# Altium schematic sheet USB-UART Converter (CP2102).SchDoc: - - - - -
size A4; ApprovedBy: LD Stanton; Author: LD Stanton; CompanyName: University of Cape Town; DrawnBy: Lawrence Stanton; Engineer: Lawrence Stanton; Organization: University of Cape Town; Address1: Department of Electrical Engineering; Address2: Rondebosch; Address3: Cape Town; Address4: South Africa 7701; DocumentNumber: 16; SheetNumber: 16; SheetTotal: 20
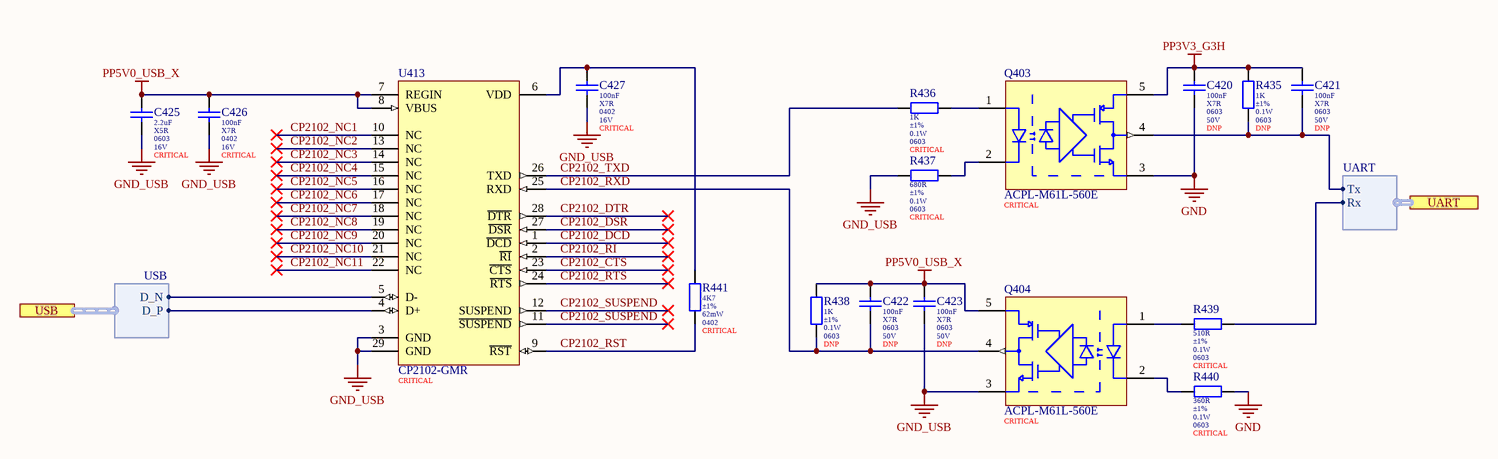
[diagram p0: USB-UART Converter (CP2102).SchDoc]

## Parts
C420  value 100nF  Dielectric: X7R  Package: 0603  Voltage: 50V  Populate: DNP  [0603 (Yageo DA) B]  (hidden comment: CC0603KRX7R9BB104)
C421  value 100nF  Dielectric: X7R  Package: 0603  Voltage: 50V  Populate: DNP  [0603 (Yageo DA) B]  (hidden comment: CC0603KRX7R9BB104)
C422  value 100nF  Dielectric: X7R  Package: 0603  Voltage: 50V  Populate: DNP  [0603 (Yageo DA) B]  (hidden comment: CC0603KRX7R9BB104)
C423  value 100nF  Dielectric: X7R  Package: 0603  Voltage: 50V  Populate: DNP  [0603 (Yageo DA) B]  (hidden comment: CC0603KRX7R9BB104)
C425  value 2.2uF  Dielectric: X5R  Package: 0603  Voltage: 16V  Populate: CRITICAL  [0603_080_8 (Samsung) B]  (hidden comment: CL10A225KO8NNNC)
C426  value 100nF  Dielectric: X7R  Package: 0402  Voltage: 16V  Populate: CRITICAL  [0402_050_5 (Samsumg) B]  (hidden comment: CL05B104KO5NNNC)
C427  value 100nF  Dielectric: X7R  Package: 0402  Voltage: 16V  Populate: CRITICAL  [0402_050_5 (Samsumg) B]  (hidden comment: CL05B104KO5NNNC)
Q403  ACPL-M61L-560E  Placement: CRITICAL  [SO-5 (ACPL) B]
Q404  ACPL-M61L-560E  Placement: CRITICAL  [SO-5 (ACPL) B]
R435  value 1K  Tolerance: ±1%  Power: 0.1W  Package: 0603  Populate: DNP  [0603 (Uniroyal) B]  (hidden comment: 0603WAF1001T5E)
R436  value 1K  Tolerance: ±1%  Power: 0.1W  Package: 0603  Populate: CRITICAL  [0603 (Uniroyal) B]  (hidden comment: 0603WAF1001T5E)
R437  value 680R  Tolerance: ±1%  Power: 0.1W  Package: 0603  Populate: CRITICAL  [0603 (Uniroyal) B]  (hidden comment: 0603WAF6800T5E)
R438  value 1K  Tolerance: ±1%  Power: 0.1W  Package: 0603  Populate: DNP  [0603 (Uniroyal) B]  (hidden comment: 0603WAF1001T5E)
R439  value 510R  Tolerance: ±1%  Power: 0.1W  Package: 0603  Populate: CRITICAL  [0603 (Uniroyal) B]  (hidden comment: 0603WAF5100T5E)
R440  value 360R  Tolerance: ±1%  Power: 0.1W  Package: 0603  Populate: CRITICAL  [0603 (Uniroyal) B]  (hidden comment: 0603WAF3600T5E)
R441  value 4K7  Tolerance: ±1%  Power: 62mW  Package: 0402  Populate: CRITICAL  [0402 (Uniroyal) C]  (hidden comment: 0402WGF4701TCE)
U413  CP2102-GMR  Placement: CRITICAL  [QFN28 (CP2102-GMR) C]

## Ports
UART (harness UART), USB (harness USB)

## Harnesses
USB: D_P, D_N
UART: Rx, Tx

## Nets
GND: C420.2 Q403.3(GND) R440.2
GND_USB: C423.2 C425.2 C426.2 C427.2 Q404.3(GND) R437.1 U413.3(GND) U413.29(GND)
PP3V3_G3H: C420.1 C421.1 Q403.5(VDD) R435.2
PP5V0_USB_X: C422.1 C423.1 C425.1 C426.1 Q404.5(VDD) R438.2 U413.7(REGIN) U413.8(VBUS)
CP2102_CTS: U413.23(~{CTS})
CP2102_DCD: U413.1(~{DCD})
CP2102_DSR: U413.27(~{DSR})
CP2102_DTR: U413.28(~{DTR})
CP2102_NC1: U413.10(NC)
CP2102_NC2: U413.13(NC)
CP2102_NC3: U413.14(NC)
CP2102_NC4: U413.15(NC)
CP2102_NC5: U413.16(NC)
CP2102_NC6: U413.17(NC)
CP2102_NC7: U413.18(NC)
CP2102_NC8: U413.19(NC)
CP2102_NC9: U413.20(NC)
CP2102_NC10: U413.21(NC)
CP2102_NC11: U413.22(NC)
CP2102_RI: U413.2(~{RI})
CP2102_RST: R441.2 U413.9(~{RST})
CP2102_RTS: U413.24(~{RTS})
CP2102_RXD: C422.2 Q404.4(VO) R438.1 U413.25(RXD)
CP2102_~{SUSPEND}: U413.11(~{SUSPEND})
CP2102_SUSPEND: U413.12(SUSPEND)
CP2102_TXD: R436.1 U413.26(TXD)
NetC421_2: C421.2 Q403.4(VO) R435.1 ; port UART.Tx
NetC427_1: C427.1 R441.1 U413.6(VDD)
NetQ403_1: Q403.1(A) R436.2
NetQ403_2: Q403.2(C) R437.2
NetQ404_1: Q404.1(A) R439.1
NetQ404_2: Q404.2(C) R440.1
NetR439_2: R439.2 ; port UART.Rx
NetU413_4: U413.4(D+) ; port USB.D_P
NetU413_5: U413.5(D-) ; port USB.D_N

## Notes on the sheet
- Size:
- Date:
- A4
- Number:
- Time:
- Revision:
- Sheet
- of
- File:
- Author:

## Library data of the parts
C420-C423 = CMP-047-000000-7: MLCC 100nF 50V 0603 X7R ±10%; Manufacturer: Yageo; LCSC Part Number: C14663; Tolerance: ±10%; ComponentLink1URL: https://datasheet.lcsc.com/szlcsc/YAGEO-CC0603KRX7R9BB104_C14663.pdf; ComponentLink1Description: Datasheet
C425 = CMP-045-000016-8: MLCC 2.2uF 0603 16V X5R ±10%; Manufacturer: Samsung; ComponentLink1URL: https://datasheet.lcsc.com/szlcsc/Samsung-Electro-Mechanics-CL05C100JB5NNNC_C32949.pdf; LCSC Part Number: C23630; Tolerance: ±10%; ComponentLink1Description: Datasheet
C426 C427 = CMP-045-000014-12: MLCC 100nF 0402 16V X7R ±10%; Manufacturer: Samsung; ComponentLink1Description: Datasheet; ComponentLink1URL: https://datasheet.lcsc.com/szlcsc/Samsung-Electro-Mechanics-CL05C100JB5NNNC_C32949.pdf; LCSC Part Number: C1525; Tolerance: ±10%
Q403 Q404 = CMP-00026-00000-1: Optocoupler Logic-Out Totem-Pole DC-IN 1-CH SO-5; Propagation Delay: 80ns; Forward Voltage: 1.3V; Forward Current: 2mA; Output Current: 10mA; Isolation Voltage: 3.75kV; ComponentLink1URL: https://datasheet.lcsc.com/lcsc/1912111437_AVAGO-Broadcom-ACPL-M61L-500E_C44908.pdf; Case/Package: SO; ComponentLink1Description: Datasheet; LCSC Part Number: C691956; Min Operating Temperature: -40°C; Max Operating Temperature: 105°C; RoHS Compliant: Yes
R435 R436 R438 = CMP-010-000308-10: Resistor 1K0 0603 ±1% Thick Film Uniroyal; Working Voltage: 50V; Temperature Coefficient: ±100ppm/K; ComponentLink1URL: https://datasheet.lcsc.com/szlcsc/1811062009_UNI-ROYAL-Uniroyal-Elec-0603WAF1002T5E_C25804.pdf; LCSC Part Number: C21190; Pin Count: 2; Manufacturer: Uniroyal; ComponentLink1Description: Datasheet; Temperature: -55 - 155°C
R437 = CMP-010-000394-2: Resistor 680R 0603 ±1% Thick Film Uniroyal; Working Voltage: 50V; Temperature Coefficient: ±100ppm/K; ComponentLink1Description: Datasheet; Pin Count: 2; ComponentLink1URL: https://datasheet.lcsc.com/szlcsc/1811062009_UNI-ROYAL-Uniroyal-Elec-0603WAF1002T5E_C25804.pdf; Temperature: -55 - 155°C; Manufacturer: Uniroyal; LCSC Part Number: C23228
R439 = CMP-010-000390-1: Resistor 510R 0603 ±1% Thick Film Uniroyal; Temperature Coefficient: ±200ppm/K; Working Voltage: 50V; Pin Count: 2; LCSC Part Number: C23193; ComponentLink1URL: https://datasheet.lcsc.com/szlcsc/1811062009_UNI-ROYAL-Uniroyal-Elec-0603WAF1002T5E_C25804.pdf; Temperature: -55 - 155°C; Manufacturer: Uniroyal; ComponentLink1Description: Datasheet
R440 = CMP-010-000392-1: Resistor 360R 0603 ±1% Thick Film Uniroyal; Working Voltage: 50V; Temperature Coefficient: ±200ppm/K; ComponentLink1URL: https://datasheet.lcsc.com/szlcsc/1811062009_UNI-ROYAL-Uniroyal-Elec-0603WAF1002T5E_C25804.pdf; LCSC Part Number: C25194; Temperature: -55 - 155°C; Pin Count: 2; Manufacturer: Uniroyal; ComponentLink1Description: Datasheet
R441 = CMP-010-000338-12: Resistor 4K7 0402 ±1% Thick Film Uniroyal; Temperature Coefficient: ±100ppm/K; Working Voltage: 50V; Temperature: -55 - 155°C; ComponentLink1URL: https://datasheet.lcsc.com/szlcsc/1811062009_UNI-ROYAL-Uniroyal-Elec-0603WAF1002T5E_C25804.pdf; Manufacturer: Uniroyal; LCSC Part Number: C25900; Pin Count: 2; ComponentLink1Description: Datasheet
U413 = CMP-000046-6: USB to UART Bridge QFN28; ComponentLink1Description: Datasheet; Max Operating Temperature: 85°C; LCSC Part Number: C6568; ComponentLink1URL: https://datasheet.lcsc.com/lcsc/1811081920_SILICON-LABS-CP2102-GMR_C6568.pdf; RoHS Compliant: Yes; Case/Package: QFN